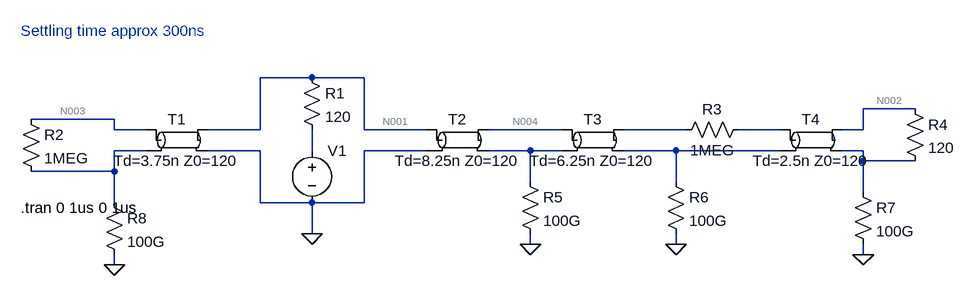
[diagram p0: schematic linearDraft01.asc]
linearDraft01.asc, the LTspice schematic file:
Version 4
SHEET 1 1248 680
WIRE 256 -16 176 -16
WIRE 336 -16 256 -16
WIRE 1184 32 1104 32
WIRE -48 48 -176 48
WIRE -48 64 -48 48
WIRE 0 64 -48 64
WIRE 176 64 176 -16
WIRE 176 64 96 64
WIRE 336 64 336 -16
WIRE 432 64 336 64
WIRE 640 64 528 64
WIRE 832 64 736 64
WIRE 976 64 912 64
WIRE 1104 64 1104 32
WIRE 1104 64 1072 64
WIRE 0 96 -48 96
WIRE 176 96 96 96
WIRE 256 96 256 64
WIRE 432 96 336 96
WIRE 592 96 528 96
WIRE 640 96 592 96
WIRE 816 96 736 96
WIRE 976 96 816 96
WIRE 1104 96 1072 96
WIRE 1104 112 1104 96
WIRE 1184 112 1104 112
WIRE -48 128 -48 96
WIRE -48 128 -176 128
WIRE 592 144 592 96
WIRE 816 144 816 96
WIRE 1104 160 1104 112
WIRE -48 176 -48 128
WIRE 176 176 176 96
WIRE 256 176 176 176
WIRE 336 176 336 96
WIRE 336 176 256 176
WIRE 256 224 256 176
WIRE 592 240 592 224
WIRE 816 240 816 224
WIRE 1104 256 1104 240
WIRE -48 272 -48 256
FLAG 256 224 0
FLAG 592 240 0
FLAG 816 240 0
FLAG 1104 256 0
FLAG -48 272 0
SYMBOL tline 48 80 R0
SYMATTR InstName T1
SYMATTR Value Td=3.75n Z0=120
SYMBOL tline 480 80 R0
SYMATTR InstName T2
SYMATTR Value Td=8.25n Z0=120
SYMBOL tline 688 80 R0
SYMATTR InstName T3
SYMATTR Value Td=6.25n Z0=120
SYMBOL tline 1024 80 R0
SYMATTR InstName T4
SYMATTR Value Td=2.5n Z0=120
SYMBOL voltage 256 80 R0
WINDOW 3 377 96 Invisible 2
WINDOW 123 0 0 Left 2
WINDOW 39 0 0 Left 2
SYMATTR Value PULSE(0 4 0 0 0 80000 80000 1)
SYMATTR InstName V1
SYMBOL res 240 -32 R0
SYMATTR InstName R1
SYMATTR Value 120
SYMBOL res -192 32 R0
SYMATTR InstName R2
SYMATTR Value 1MEG
SYMBOL res 928 48 R90
WINDOW 0 0 56 VBottom 2
WINDOW 3 32 56 VTop 2
SYMATTR InstName R3
SYMATTR Value 1MEG
SYMBOL res 1168 16 R0
SYMATTR InstName R4
SYMATTR Value 120
SYMBOL res 576 128 R0
SYMATTR InstName R5
SYMATTR Value 100G
SYMBOL res 800 128 R0
SYMATTR InstName R6
SYMATTR Value 100G
SYMBOL res 1088 144 R0
SYMATTR InstName R7
SYMATTR Value 100G
SYMBOL res -64 160 R0
SYMATTR InstName R8
SYMATTR Value 100G
TEXT -192 184 Left 2 !.tran 0 1us 0 1us
TEXT -192 -88 Left 2 ;Settling time approx 300ns

The netlist it stands for:
* linearDraft01.asc
T1 N003 N007 N001 0 Td=3.75n Z0=120
T2 N001 0 N004 N009 Td=8.25n Z0=120
T3 N004 N009 N005 N010 Td=6.25n Z0=120
T4 N006 N010 N002 N011 Td=2.5n Z0=120
V1 N008 0 PULSE(0 4 0 0 0 80000 80000 1)
R1 N001 N008 120
R2 N003 N007 1MEG
R3 N006 N005 1MEG
R4 N002 N011 120
R5 N009 0 100G
R6 N010 0 100G
R7 N011 0 100G
R8 N007 0 100G
.tran 0 1us 0 1us
* Settling time approx 300ns
.backanno
.end

* Results of the author's LTspice run, read from the files saved beside the schematic
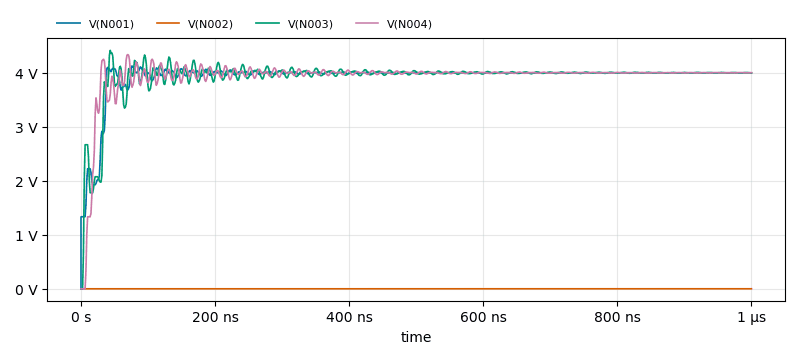
[diagram p1: Transient Analysis of linearDraft01.asc, plotted from the saved traces]
* Transient Analysis, 1 run:
*   V(N001): min 0 V, max 4.124 V, average 3.926 V, rms 3.943 V, last 3.998 V
*   V(N002): min 0 V, max 539.6 µV, average 469.9 µV, rms 474.2 µV, last 479.8 µV
*   V(N003): min 0 V, max 4.413 V, average 3.925 V, rms 3.946 V, last 3.995 V
*   V(N004): min 0 V, max 4.336 V, average 3.926 V, rms 3.952 V, last 4 V